# Altium project WS485H-V2_Project.PrjPcb
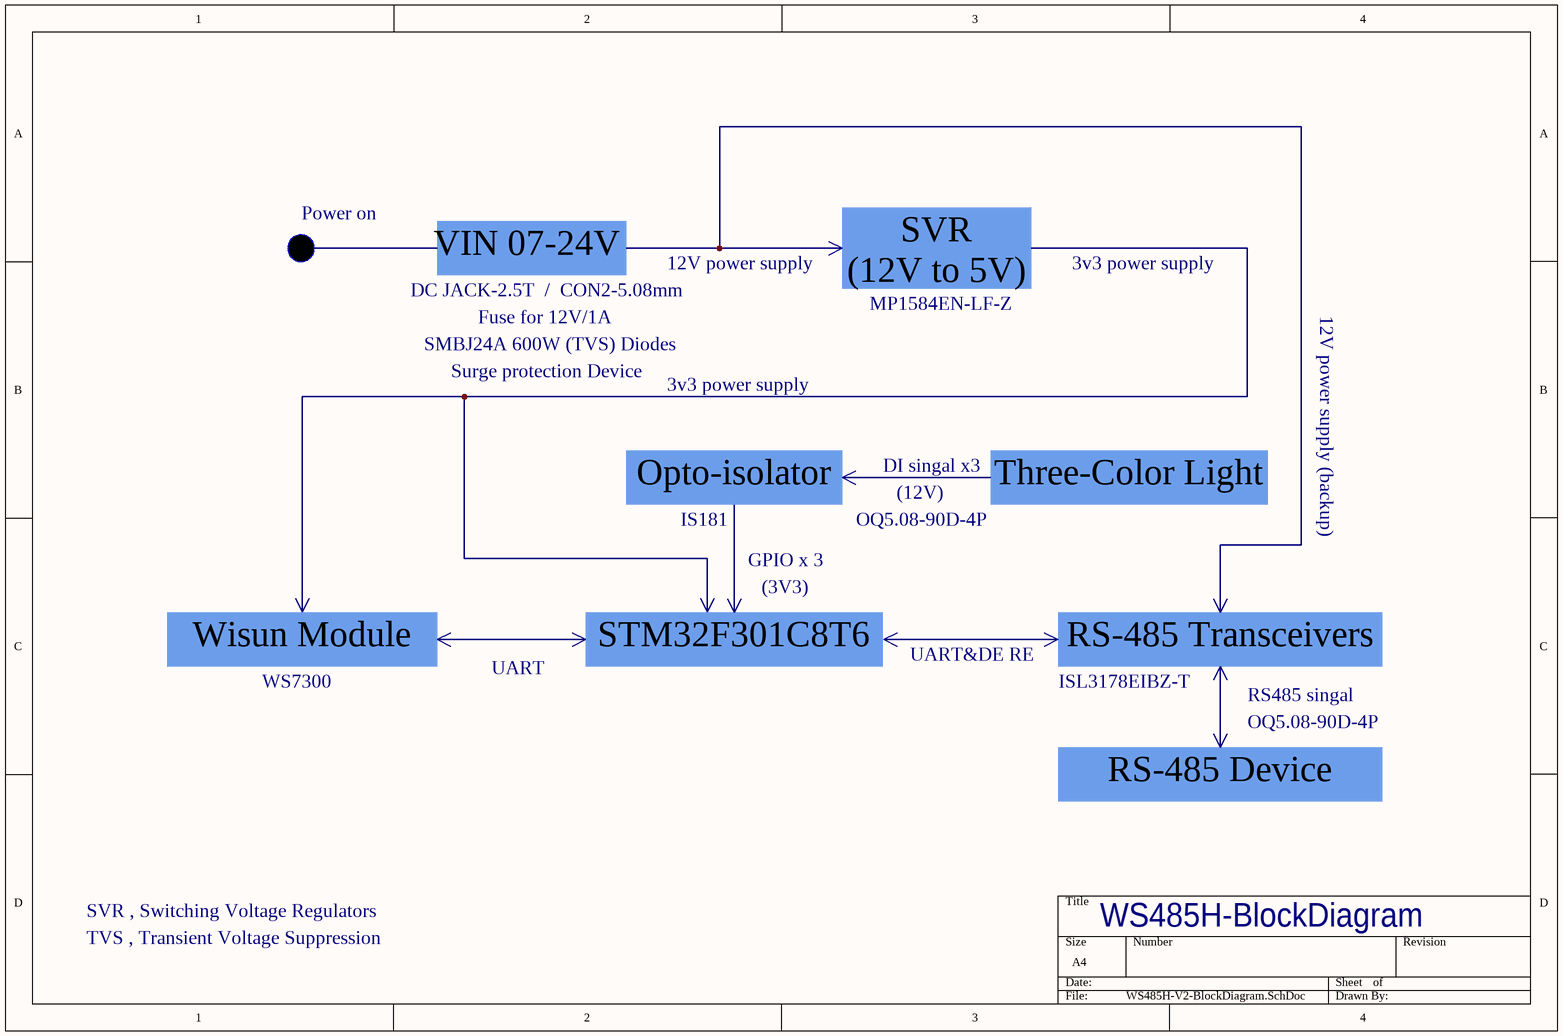
[diagram p0: WS485H-V2-BlockDiagram.SchDoc]
1 sheet, 12 parts. Net scope: global (net labels, ports and power ports of the same name join across sheets).
Board file: WS485H-V2.PcbDoc

## Sheet WS485H-V2-BlockDiagram.SchDoc: WS485H-BlockDiagram
size A4; Author: Fred; PageSetup: Record=PageOptions|CenterHorizontal=True|CenterVertical=True|PrintScale=1.00|XCorrection=1.00|YCorrection=1.00|PrintKind=0|BorderSize=5000000|LeftOffset=0|BottomOffset=0|Orientation=2|PaperLength=1000|PaperWidth=1000|Scale=100|PaperSource=7|PrintQuality=-4|MediaType=1|DitherType=10|PaperKind=A4|PrintScaleMode=1

### Parts
*1  Component_1  (value not drawn)
*2  Component_1  (value not drawn)
*3  Component_1  (value not drawn)
*4  Component_1  (value not drawn)
*5  Component_1  (value not drawn)
*6  Component_1  (value not drawn)
*7  Component_1  (value not drawn)
*8  Component_1  (value not drawn)
*9  Component_1  (value not drawn)
*10  Component_1  (value not drawn)
*11  Component_1  (value not drawn)
*12  Component_1  (value not drawn)

### Notes on the sheet
- Power on
- DC JACK-2.5T  /  CON2-5.08mm
- VIN 07-24V
- (near *1) 12V power supply
- (near *1) SVR
  (12V to 5V)
- MP1584EN-LF-Z
- 3v3 power supply
- 12V power supply (backup)
- SMBJ24A 600W (TVS) Diodes
- Surge protection Device
- Fuse for 12V/1A
- (near *2) Opto-isolator
- (near *2) DI singal x3
- (near *2) (12V)
- Three-Color Light
- IS181
- (near *5) GPIO x 3
- (near *2) OQ5.08-90D-4P
- (near *5) (3V3)
- Wisun Module
- WS7300
- UART
- STM32F301C8T6
- (near *9) UART&DE RE
- RS-485 Transceivers
- ISL3178EIBZ-T
- RS485 singal
- OQ5.08-90D-4P
- (near *12) RS-485 Device
- SVR , Switching Voltage Regulators
- TVS , Transient Voltage Suppression